# EasyEDA schematic easyeda_flashinglights.json
TITLE: Sheet_1; REV: 1.0; Date: 2024-07-08; Sheet: 1/1; Drawn By: snipchu; Company: Your Company
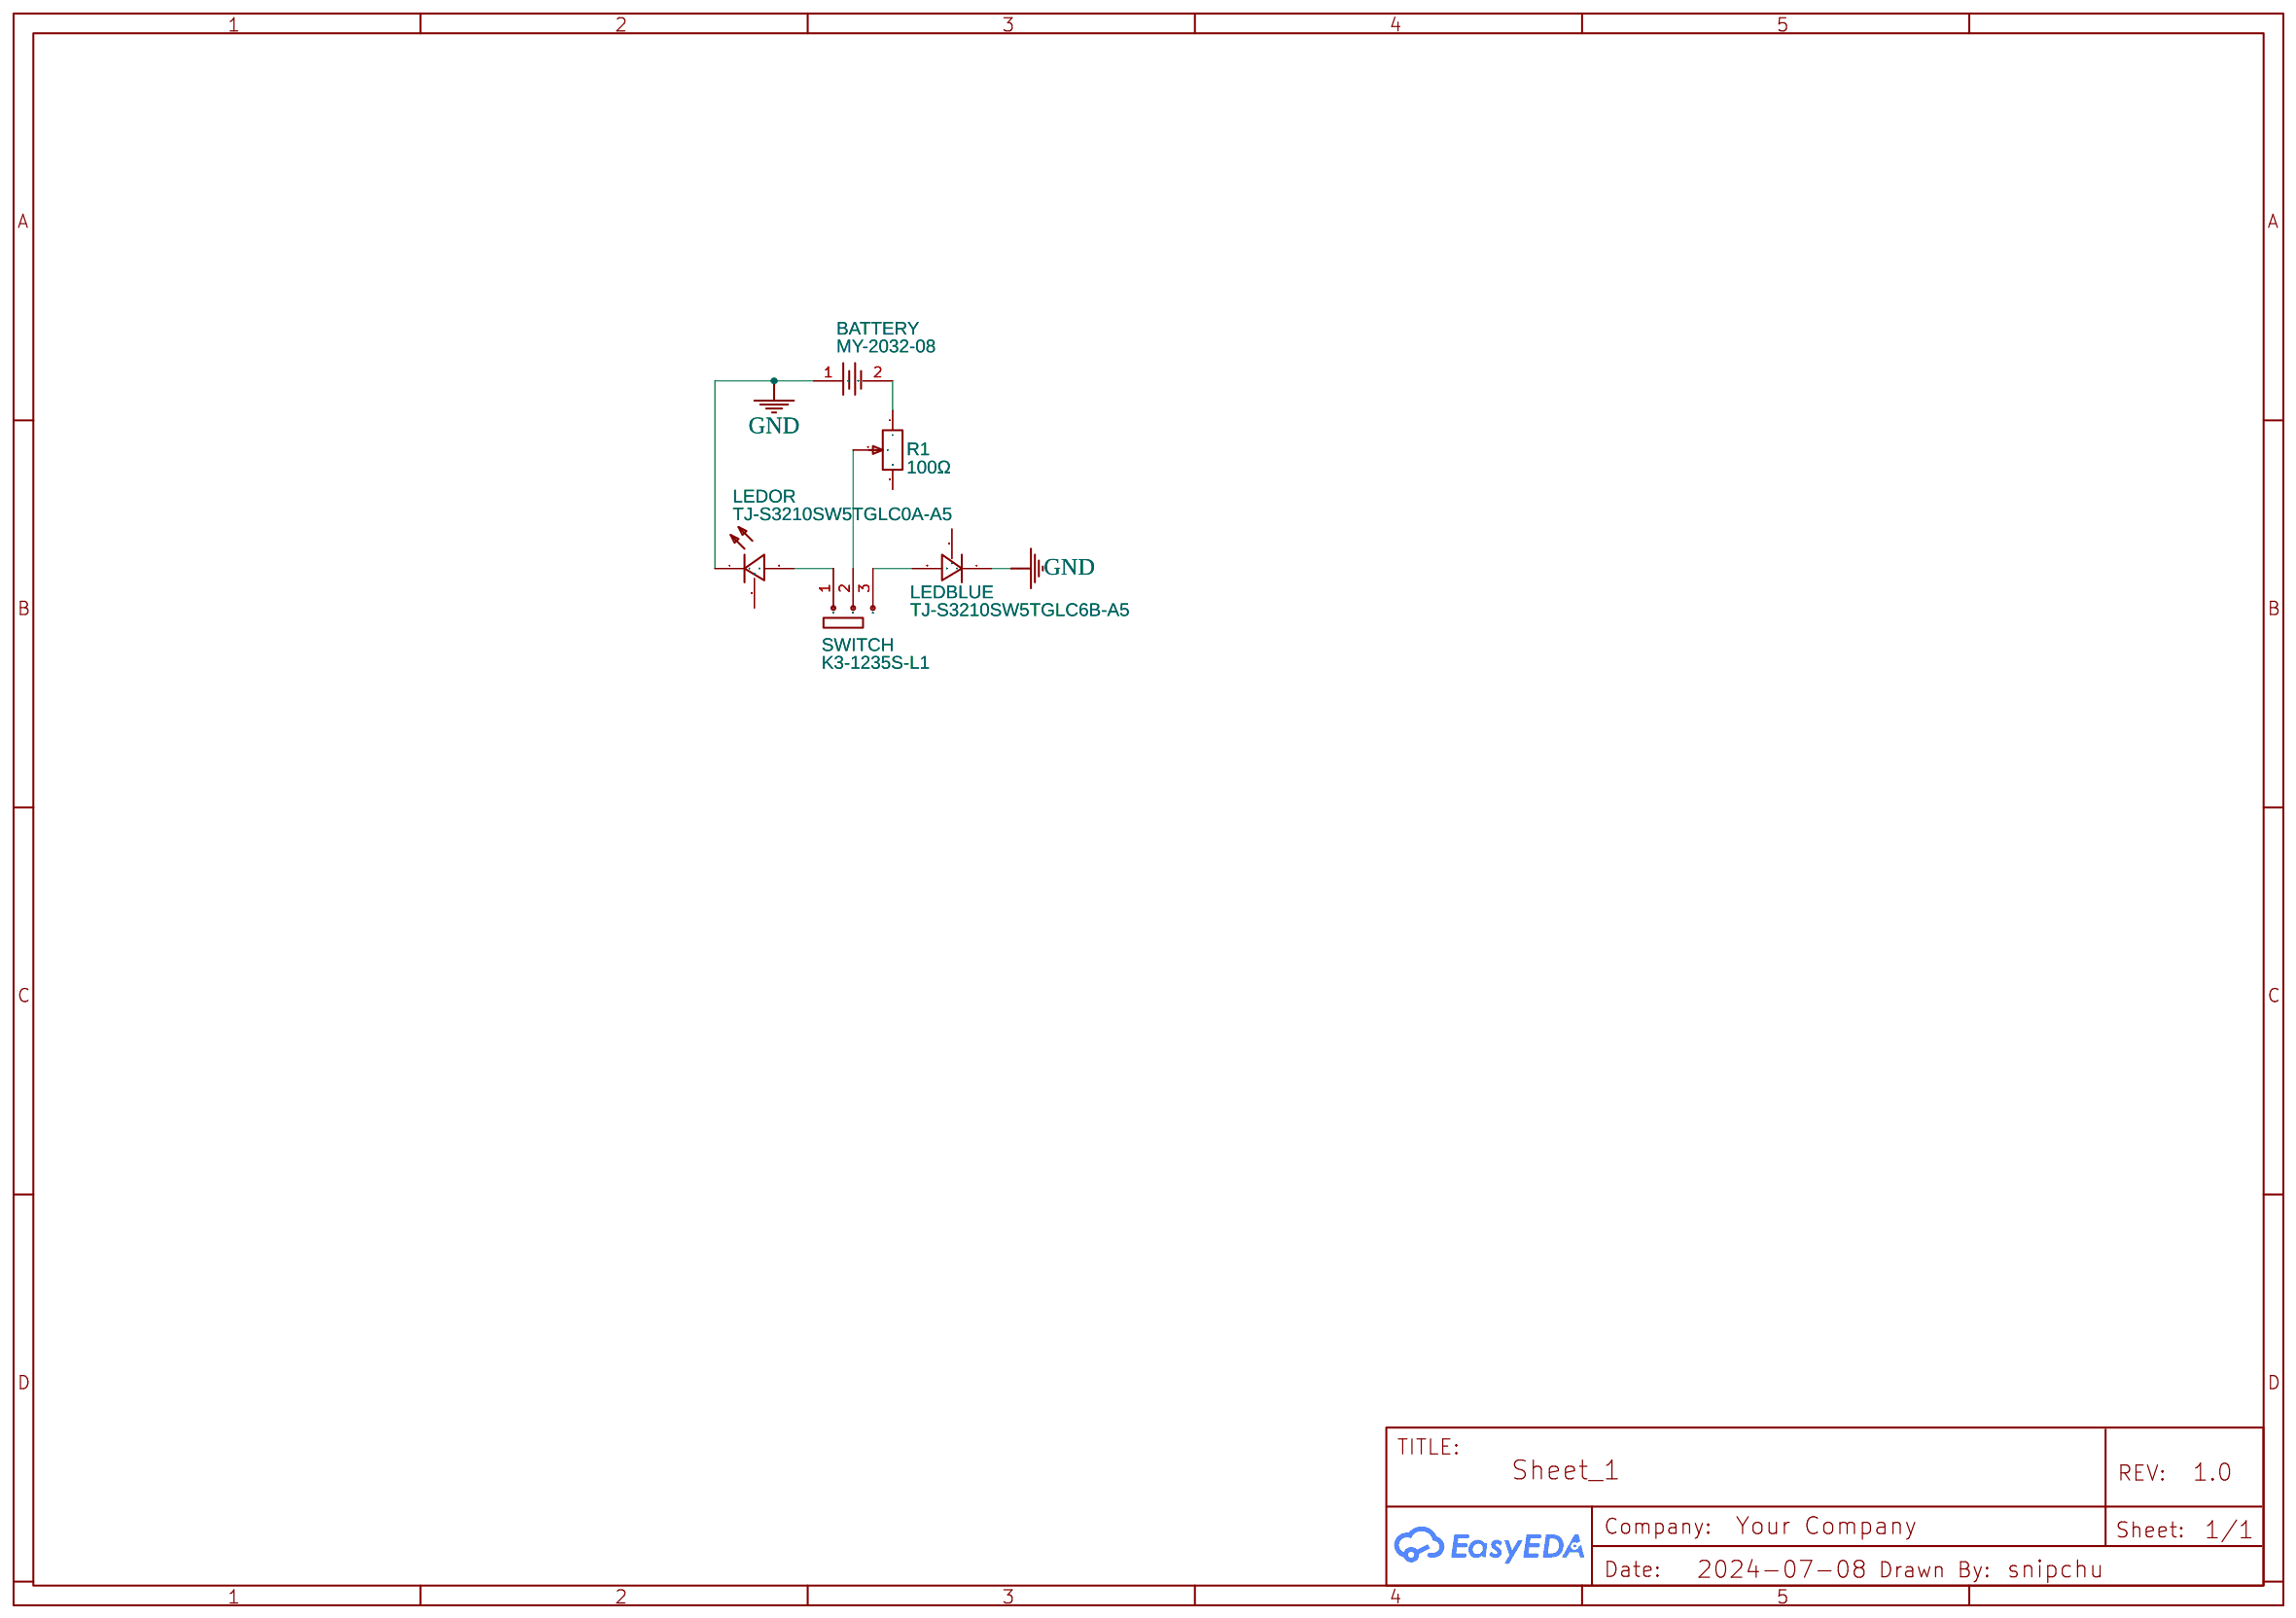
[diagram p0: schematic sheet]

## Parts
BATTERY  MY-2032-08  [BAT-SMD_MY-2032-08]
LEDBLUE  TJ-S3210SW5TGLC6B-A5  [LED-SMD_3P-L3.2-W1.0-RD]
LEDOR  TJ-S3210SW5TGLC0A-A5  [LED-SMD_3P-L3.2-W1.0-RD_ORANGE]
R1  100Ω  [RES-ADJ-SMD_G43AT]
SWITCH  K3-1235S-L1  [SW-TH_K3-1235S-L1]

## Library data of the parts
BATTERY = MY-2032-08: Contributor: LCSC; Supplier: LCSC; Supplier Part: C964831; Manufacturer: MYOUNG(美阳); JLCPCB Part Class: Extended Part
LEDBLUE = TJ-S3210SW5TGLC6B-A5: Contributor: LCSC; Supplier: LCSC; Supplier Part: C273631; Manufacturer: TOGIALED(统佳); JLCPCB Part Class: Extended Part
LEDOR = TJ-S3210SW5TGLC0A-A5: Contributor: LCSC; Supplier: LCSC; Supplier Part: C273627; Manufacturer: TOGIALED(统佳); JLCPCB Part Class: Extended Part
R1 = G43AT-B101: Resistance(Ohms): 100; Contributor: LCSC; Supplier: LCSC; Manufacturer: TOCOS; Supplier Part: C128153; JLCPCB Part Class: Extended Part
SWITCH = K3-1235S-L1: Contributor: LCSC; Supplier: LCSC; Supplier Part: C223838; Manufacturer: 韩国韩荣; JLCPCB Part Class: Extended Part

## Nets
GND: BATTERY.1 LEDBLUE.1 LEDOR.1
Net-(BATTERY-2): BATTERY.2 R1.1
Net-(LEDBLUE-2): LEDBLUE.2 SWITCH.3
Net-(LEDOR-2): LEDOR.2 SWITCH.1
Net-(R1-2): R1.2 SWITCH.2

Not connected (* = marked no-connect by the designer): LEDBLUE 3; LEDOR 3; R1 3
